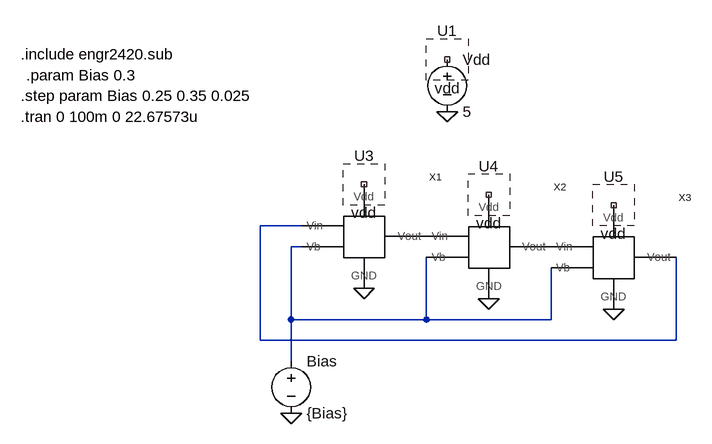
[diagram p0: schematic RingOscillator.asc]
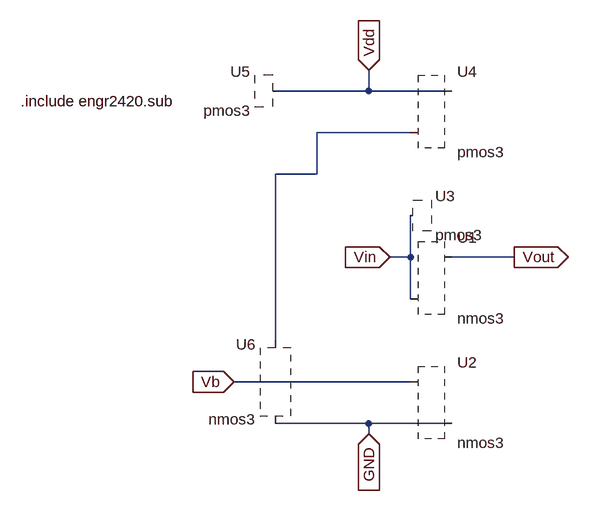
[diagram p1: sub-circuit currentstarvedinverter.asc]
RingOscillator.asc, the LTspice schematic file:
Version 4
SHEET 1 880 680
WIRE -288 192 -352 192
WIRE -288 224 -304 224
WIRE -304 336 -304 224
WIRE -96 336 -96 240
WIRE -96 336 -304 336
WIRE 96 336 96 256
WIRE 96 336 -96 336
WIRE -352 368 -352 192
WIRE 288 368 288 240
WIRE 288 368 -352 368
WIRE -304 400 -304 336
FLAG -304 480 0
FLAG -64 16 0
FLAG 192 320 0
FLAG 0 304 0
FLAG -192 288 0
SYMBOL voltage -304 384 R0
SYMATTR InstName Bias
SYMATTR Value {Bias}
SYMBOL voltage -64 -80 R0
WINDOW 123 0 0 Left 2
WINDOW 39 0 0 Left 2
SYMATTR InstName Vdd
SYMATTR Value 5
SYMBOL cktsym\\vdd -64 -64 R0
SYMATTR InstName U1
SYMBOL currentstarvedinverter -192 208 R0
SYMATTR InstName X1
SYMBOL currentstarvedinverter 0 224 R0
SYMATTR InstName X2
SYMBOL currentstarvedinverter 192 240 R0
SYMATTR InstName X3
SYMBOL cktsym\\vdd -192 128 R0
SYMATTR InstName U3
SYMBOL cktsym\\vdd 0 144 R0
SYMATTR InstName U4
SYMBOL cktsym\\vdd 192 160 R0
SYMATTR InstName U5
TEXT -720 24 Left 2 !.tran 0 100m 0 22.67573u
TEXT -720 -72 Left 2 !.include engr2420.sub
TEXT -720 -8 Left 2 !.step param Bias 0.25 0.35 0.025
TEXT -712 -40 Left 2 !.param Bias 0.3

currentstarvedinverter.asc, the sub-circuit schematic file:
Version 4
SHEET 1 880 680
WIRE 176 -96 176 -128
WIRE 176 -96 32 -96
WIRE 304 -96 176 -96
WIRE 240 -32 96 -32
WIRE 96 32 96 -32
WIRE 96 32 32 32
WIRE 240 160 240 96
WIRE 240 160 208 160
WIRE 400 160 304 160
WIRE 240 224 240 160
WIRE 32 288 32 32
WIRE 96 352 -32 352
WIRE 240 352 96 352
WIRE 176 416 32 416
WIRE 304 416 176 416
WIRE 176 432 176 416
FLAG 400 160 Vout
IOPIN 400 160 Out
FLAG 208 160 Vin
IOPIN 208 160 In
FLAG -32 352 Vb
IOPIN -32 352 In
FLAG 176 432 GND
IOPIN 176 432 In
FLAG 176 -128 Vdd
IOPIN 176 -128 In
SYMBOL cktsym\\nmos3 304 224 R0
SYMATTR InstName U1
SYMBOL cktsym\\nmos3 304 352 R0
SYMATTR InstName U2
SYMBOL cktsym\\pmos3 304 96 R0
SYMATTR InstName U3
SYMBOL cktsym\\pmos3 304 -32 R0
SYMATTR InstName U4
SYMBOL cktsym\\pmos3 32 -32 M0
SYMATTR InstName U5
SYMBOL cktsym\\nmos3 32 352 M0
SYMATTR InstName U6
TEXT -360 -80 Left 2 !.include engr2420.sub

The netlist it stands for:
* RingOscillator.asc
V§Bias N002 0 {Bias}
Vdd NC_01 0 5
* U1: vdd (symbol cktsym\vdd not available, pin order unknown); nets seen at it: 
XX1 N001 N002 NC_02 P001 0 currentstarvedinverter
XX2 P001 N002 NC_03 P002 0 currentstarvedinverter
XX3 P002 N002 NC_04 N001 0 currentstarvedinverter
* U3: vdd (symbol cktsym\vdd not available, pin order unknown); nets seen at it: 
* U4: vdd (symbol cktsym\vdd not available, pin order unknown); nets seen at it: 
* U5: vdd (symbol cktsym\vdd not available, pin order unknown); nets seen at it: 

* block symbol definitions
.subckt currentstarvedinverter Vin Vb Vdd Vout GND
* U1: nmos3 (symbol cktsym\nmos3 not available, pin order unknown); nets seen at it: Vin, Vout
* U2: nmos3 (symbol cktsym\nmos3 not available, pin order unknown); nets seen at it: GND, Vb
* U3: pmos3 (symbol cktsym\pmos3 not available, pin order unknown); nets seen at it: Vin
* U4: pmos3 (symbol cktsym\pmos3 not available, pin order unknown); nets seen at it: N001, Vdd
* U5: pmos3 (symbol cktsym\pmos3 not available, pin order unknown); nets seen at it: Vdd
* U6: nmos3 (symbol cktsym\nmos3 not available, pin order unknown); nets seen at it: GND, N001
.include engr2420.sub
.ends currentstarvedinverter

.tran 0 100m 0 22.67573u
.include engr2420.sub
.step param Bias 0.25 0.35 0.025
.param Bias 0.3
.backanno
.end